# Altium project RWE_Sterownik.PrjPcb
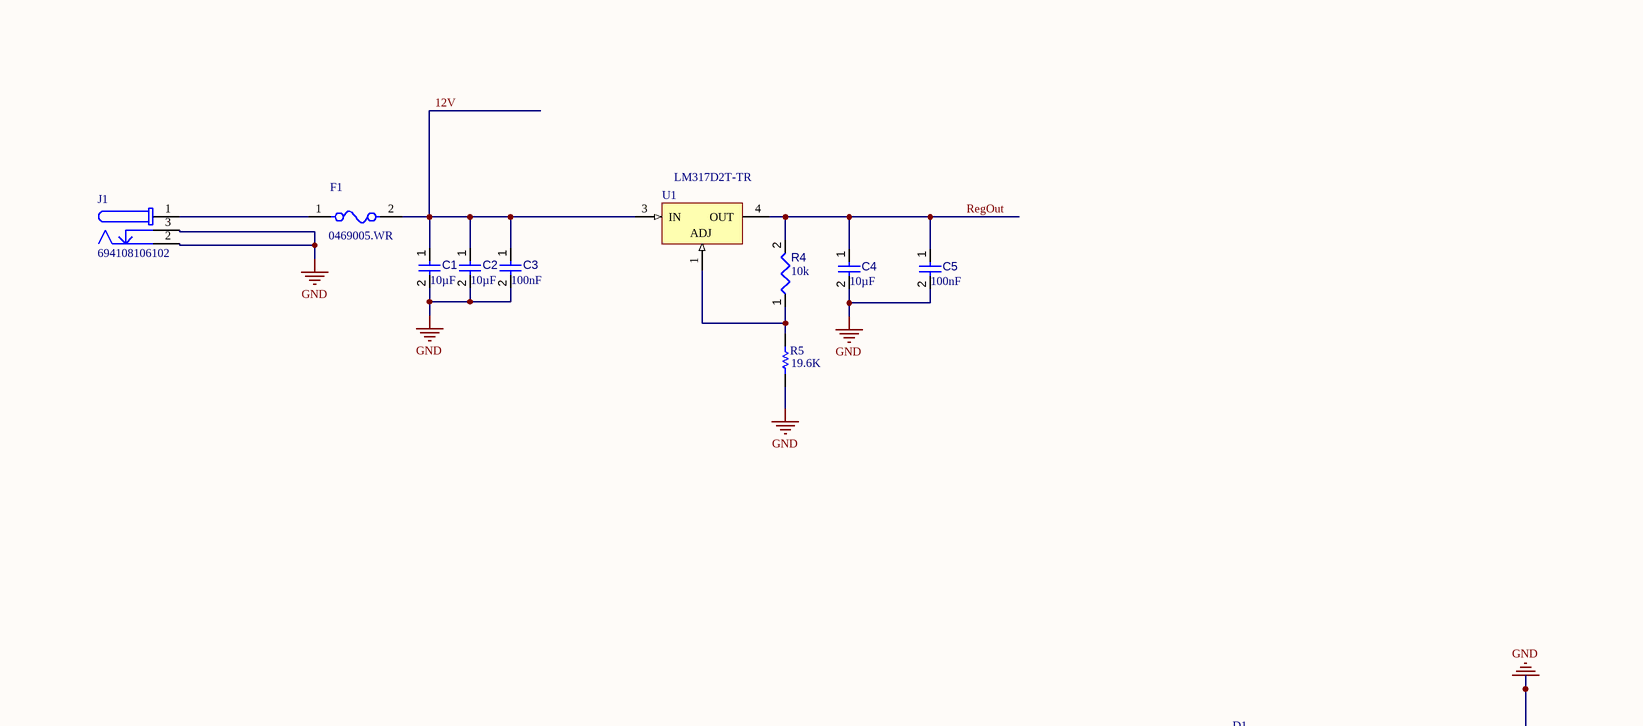
[diagram p0: Główna_Płytka.SchDoc, top left]
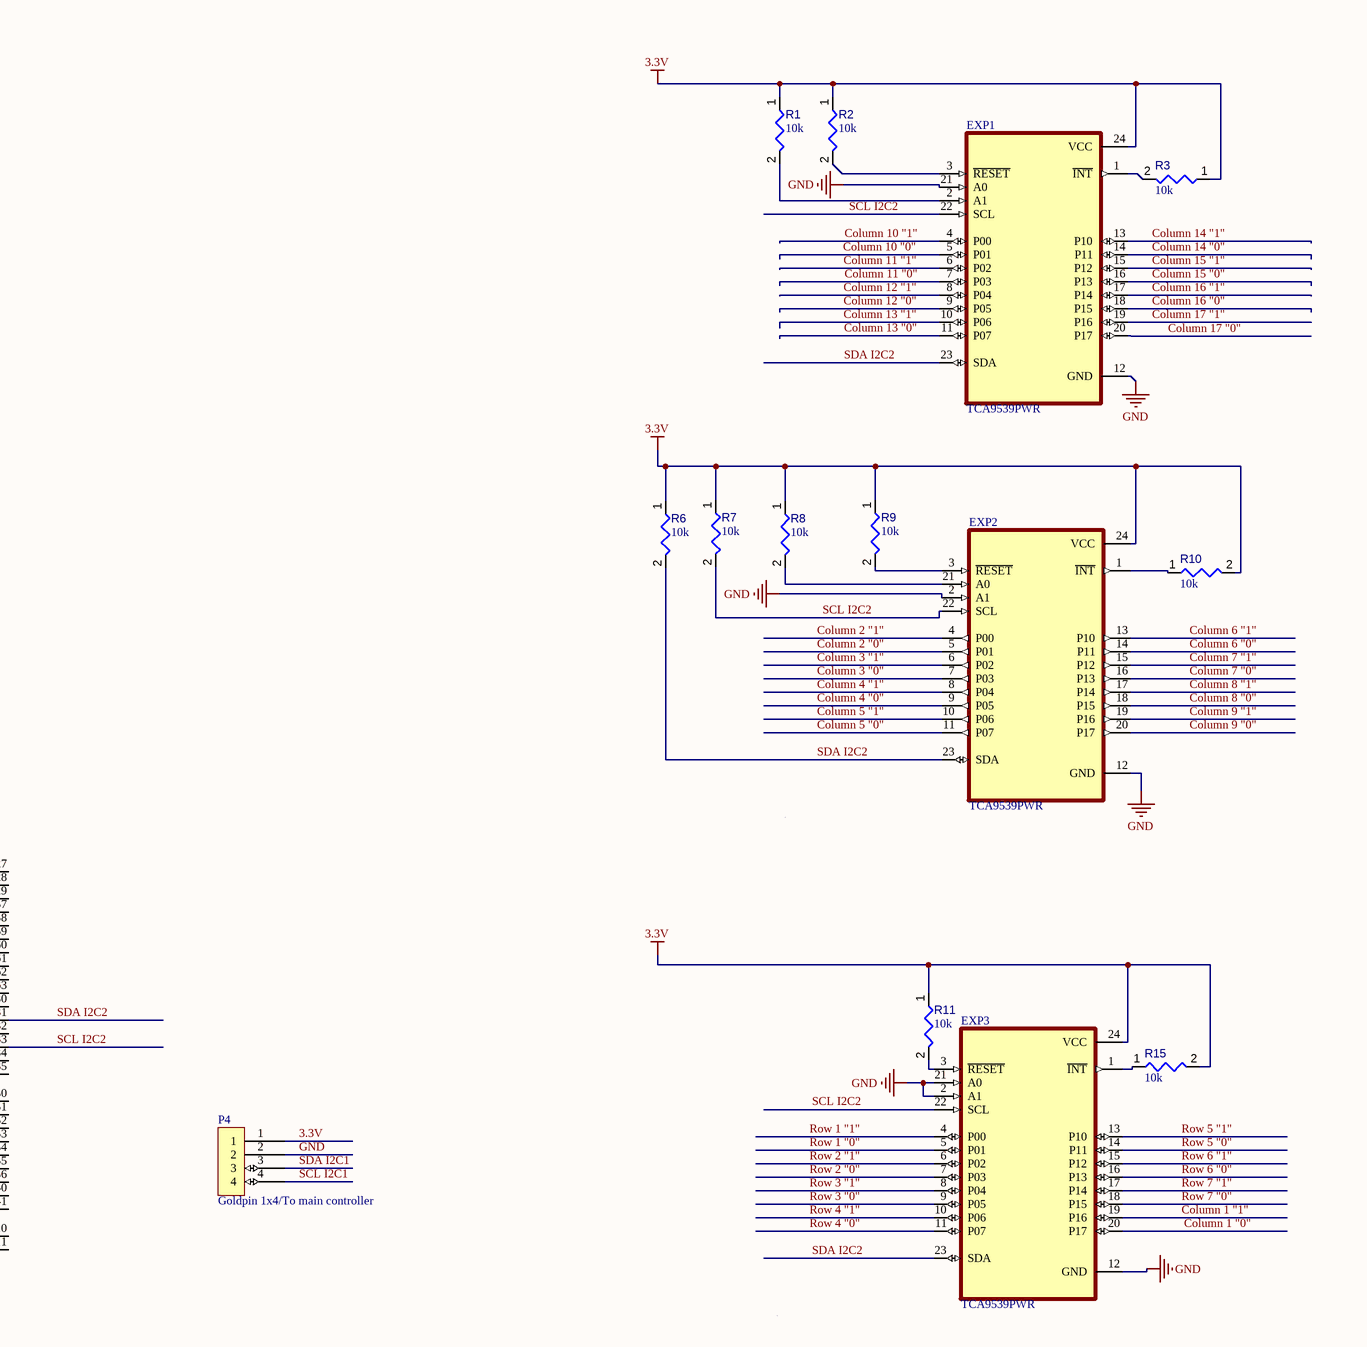
[diagram p1: Główna_Płytka.SchDoc, top middle]
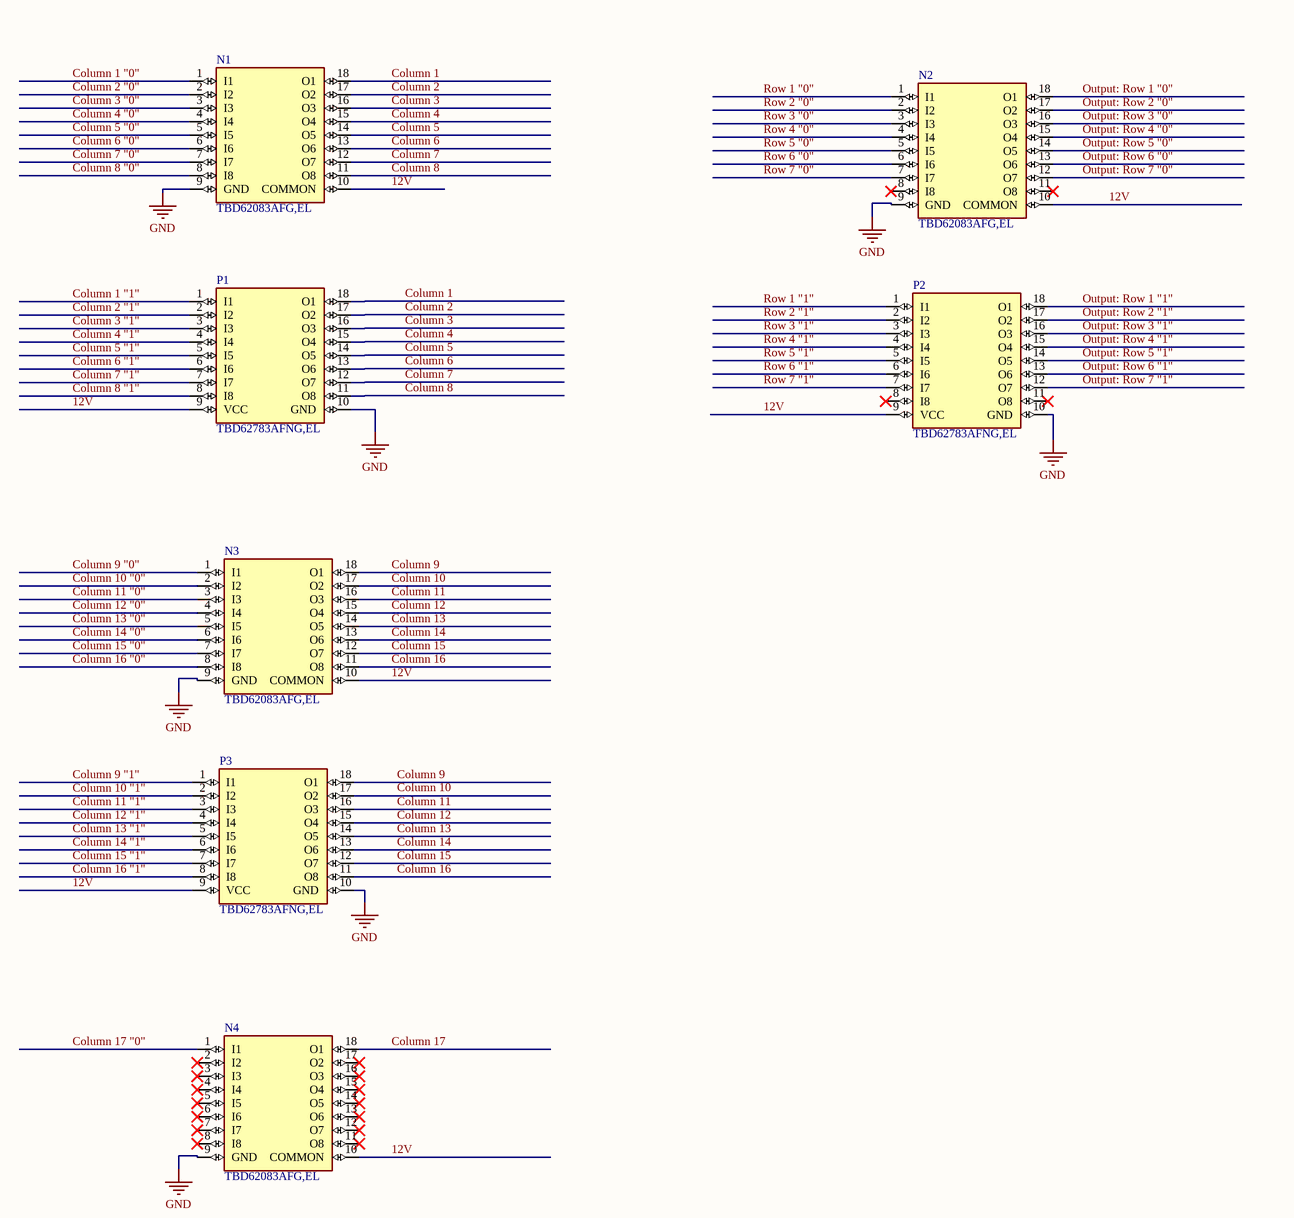
[diagram p2: Główna_Płytka.SchDoc, top right]
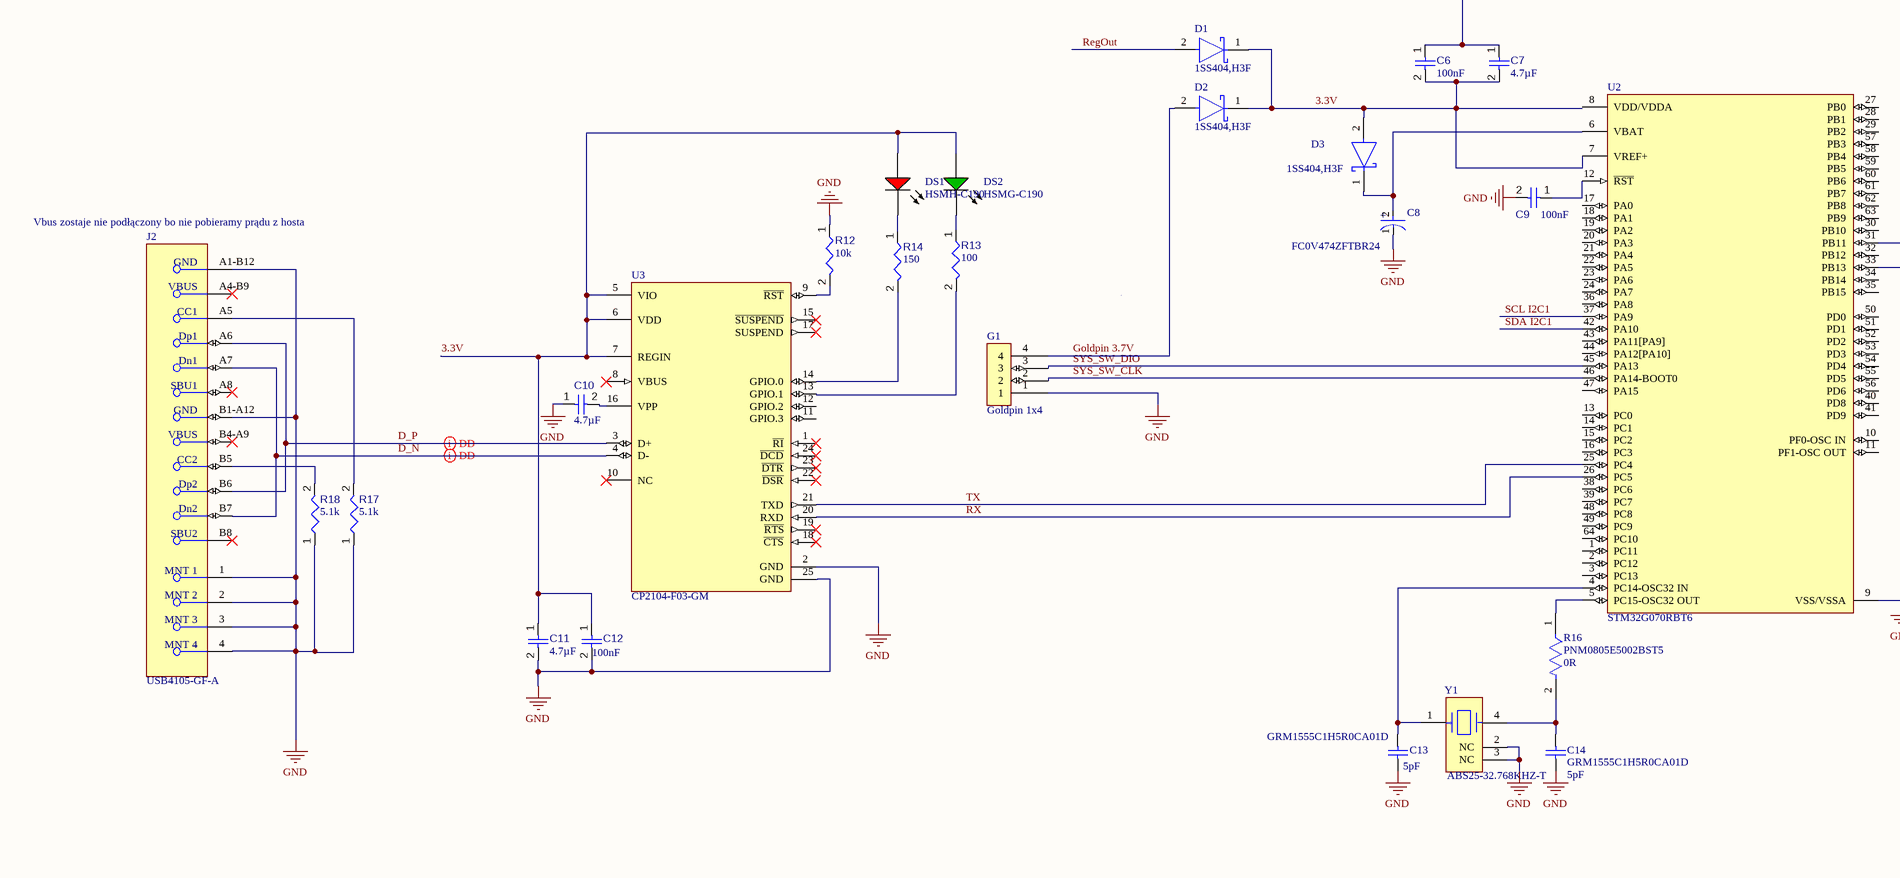
[diagram p3: Główna_Płytka.SchDoc, bottom left]
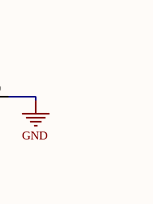
[diagram p4: Główna_Płytka.SchDoc, bottom middle]
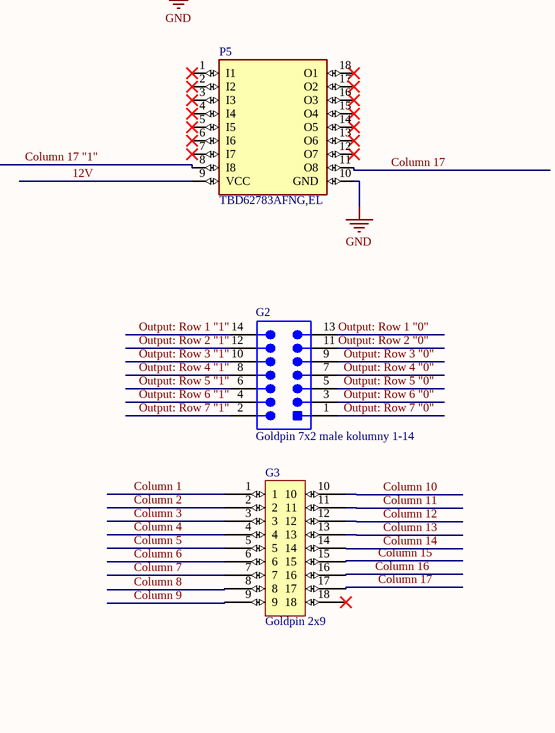
[diagram p5: Główna_Płytka.SchDoc, bottom right]
1 sheet, 59 parts. Net scope: global (net labels, ports and power ports of the same name join across sheets).
Board file: PCB1.PcbDoc

## Sheet Główna_Płytka.SchDoc
size A0; SheetNumber: 1; SheetTotal: 1

### Parts
C1  value 10µF  [CAPC0603(1608)100_L]  (hidden comment: Capacitor 10µF +/-20% 10V 0603)
C2  value 10µF  [CAPC0603(1608)100_L]  (hidden comment: Capacitor 10µF +/-20% 10V 0603)
C3  value 100nF  [CAPC0402(1005)60_L]  (hidden comment: Capacitor 100nF +/-20% 50V 0402)
C4  value 10µF  [CAPC0603(1608)100_L]  (hidden comment: Capacitor 10µF +/-20% 10V 0603)
C5  value 100nF  [CAPC0402(1005)60_L]  (hidden comment: Capacitor 100nF +/-20% 50V 0402)
C6  value 100nF  [CAPC0402(1005)60_L]  (hidden comment: Capacitor 100nF +/-20% 10V 0402)
C7  value 4.7µF  [CAPC0603(1608)100_L]  (hidden comment: Capacitor 4.7µF +/-20% 10V 0603)
C8  FC0V474ZFTBR24  [FP-FC0V474ZFTBR24-MFG]
C9  value 100nF  [CAPC0402(1005)60_L]  (hidden comment: Capacitor 100nF +/-20% 50V 0402)
C10  value 4.7µF  [CAPC0603(1608)100_L]  (hidden comment: Capacitor 4.7µF +/-20% 10V 0603)
C11  value 4.7µF  [CAPC0603(1608)100_L]  (hidden comment: Capacitor 4.7µF +/-20% 10V 0603)
C12  value 100nF  [CAPC0402(1005)60_L]  (hidden comment: Capacitor 100nF +/-20% 50V 0402)
C13  GRM1555C1H5R0CA01D  value 5pF  [CAPC1005X55X25LL05T10]
C14  GRM1555C1H5R0CA01D  value 5pF  [CAPC1005X55X25LL05T10]
D1  1SS404,H3F  [FP-SOD-323-MFG]
D2  1SS404,H3F  [FP-SOD-323-MFG]
D3  1SS404,H3F  [FP-SOD-323-MFG]
DS1  HSMH-C190  [AVAG-HSMX-C190_V]
DS2  HSMG-C190  [AVAG-HSMX-C190_V]
EXP1  TCA9539PWR  [SOP65P640X120-24N]
EXP2  TCA9539PWR  [SOP65P640X120-24N]
EXP3  TCA9539PWR  [SOP65P640X120-24N]
F1  0469005.WR  [FP-0469-MFG]
G1  Goldpin 1x4  [Goldpin 1x4-Footprint-1]
G2  Goldpin 7x2 male kolumny 1-14  [HRWN-M20-9980745_V]
G3  Goldpin 2x9  [Goldpin 2x9-Footprint-1]
J1  694108106102  [694108106102]
J2  USB4105-GF-A  [FP-USB4105-GF-A-MFG]
N1  TBD62083AFG,EL  [SOIC127P1030X245-18N]
N2  TBD62083AFG,EL  [SOIC127P1030X245-18N]
N3  TBD62083AFG,EL  [SOIC127P1030X245-18N]
N4  TBD62083AFG,EL  [SOIC127P1030X245-18N]
P1  TBD62783AFNG,EL  [New footprint 1]
P2  TBD62783AFNG,EL  [New footprint 1]
P3  TBD62783AFNG,EL  [New footprint 1]
P4  Goldpin 1x4/To main controller  [Goldpin 1x4-Footprint-1]
P5  TBD62783AFNG,EL  [New footprint 1]
R1  value 10k  [RESC2013X50X35ML15T15]  (hidden comment: Resistor 10k +/-1% 0805 125 mW)
R2  value 10k  [RESC2013X50X35ML15T15]  (hidden comment: Resistor 10k +/-1% 0805 125 mW)
R3  value 10k  [RESC2013X50X35ML15T15]  (hidden comment: Resistor 10k +/-1% 0805 125 mW)
R4  value 10k  [RESC2013X50X35ML15T15]  (hidden comment: Resistor 10k +/-1% 0805 125 mW)
R5  value 19.6K  [RESC1005X40X25NL05T05]  (hidden comment: ERJ-2RKF1962X)
R6  value 10k  [RESC2013X50X35ML15T15]  (hidden comment: Resistor 10k +/-1% 0805 125 mW)
R7  value 10k  [RESC2013X50X35ML15T15]  (hidden comment: Resistor 10k +/-1% 0805 125 mW)
R8  value 10k  [RESC2013X50X35ML15T15]  (hidden comment: Resistor 10k +/-1% 0805 125 mW)
R9  value 10k  [RESC2013X50X35ML15T15]  (hidden comment: Resistor 10k +/-1% 0805 125 mW)
R10  value 10k  [RESC2013X50X35ML15T15]  (hidden comment: Resistor 10k +/-1% 0805 125 mW)
R11  value 10k  [RESC2013X50X35ML15T15]  (hidden comment: Resistor 10k +/-1% 0805 125 mW)
R12  value 10k  [RESC2013X50X35ML15T15]  (hidden comment: Resistor 10k +/-1% 0805 125 mW)
R13  value 100  [RESC2013X50X35ML15T15]  (hidden comment: Resistor 10k +/-1% 0805 125 mW)
R14  value 150  [RESC2013X50X35ML15T15]  (hidden comment: Resistor 10k +/-1% 0805 125 mW)
R15  value 10k  [RESC2013X50X35ML15T15]  (hidden comment: Resistor 10k +/-1% 0805 125 mW)
R16  PNM0805E5002BST5  Resistance: 0R  [FP-PNM0805-MFG]
R17  value 5.1k  [RESC2013X50X35ML15T15]  (hidden comment: Resistor 10k +/-1% 0805 125 mW)
R18  value 5.1k  [RESC2013X50X35ML15T15]  (hidden comment: Resistor 10k +/-1% 0805 125 mW)
U1  LM317D2T-TR  [TO-263_N]
U2  STM32G070RBT6  [FP-LQFP64-5W-MFG]
U3  CP2104-F03-GM  [FP-CP2104-F03-GM-MFG]
Y1  ABS25-32.768KHZ-T  [FP-ABS25-MFG]

### Nets
3.3V: C6.2 C7.2 C11.1 C12.1 D1.1(C) D2.1(C) D3.2(A) DS1.1(A) DS2.1(A) EXP1.24(VCC) EXP2.24(VCC) EXP3.24(VCC) P4.1 R1.1 R2.1 R3.1 R6.1 R7.1 R8.1 R9.1 R10.2 R11.1 R15.2 U2.7(VREF+) U3.5(VIO) U3.6(VDD) U3.7(REGIN)
GND: C1.2 C2.2 C3.2 C4.2 C5.2 C6.1 C7.1 C8.1(C) C9.2 C10.1 C11.2 C12.2 C13.1 C14.1 EXP1.12(GND) EXP1.21(A0) EXP2.2(A1) EXP2.12(GND) EXP3.2(A1) EXP3.12(GND) EXP3.21(A0) G1.1 J1.2 J1.3 J2.1(MNT_1) J2.2(MNT_2) J2.3(MNT_3) J2.4(MNT_4) J2.A1-B12(GND) J2.B1-A12(GND) N1.9(GND) N2.9(GND) N3.9(GND) N4.9(GND) P1.10(GND) P2.10(GND) P3.10(GND) P4.2 P5.10(GND) R5.2 R12.1 R17.1 R18.1 U2.9(VSS/VSSA) U3.2(GND) U3.25(GND) Y1.2(NC) Y1.3(NC)
12V: C1.1 C2.1 C3.1 F1.2 N1.10(COMMON) N2.10(COMMON) N3.10(COMMON) N4.10(COMMON) P1.9(VCC) P2.9(VCC) P3.9(VCC) P5.9(VCC) U1.3(IN)
Column 1: G3.1 N1.18(O1) P1.18(O1)
Column 1 "0": EXP3.20(P17) N1.1(I1)
Column 1 "1": EXP3.19(P16) P1.1(I1)
Column 2: G3.2 N1.17(O2) P1.17(O2)
Column 2 "0": EXP2.5(P01) N1.2(I2)
Column 2 "1": EXP2.4(P00) P1.2(I2)
Column 3: G3.3 N1.16(O3) P1.16(O3)
Column 3 "0": EXP2.7(P03) N1.3(I3)
Column 3 "1": EXP2.6(P02) P1.3(I3)
Column 4: G3.4 N1.15(O4) P1.15(O4)
Column 4 "0": EXP2.9(P05) N1.4(I4)
Column 4 "1": EXP2.8(P04) P1.4(I4)
Column 5: G3.5 N1.14(O5) P1.14(O5)
Column 5 "0": EXP2.11(P07) N1.5(I5)
Column 5 "1": EXP2.10(P06) P1.5(I5)
Column 6: G3.6 N1.13(O6) P1.13(O6)
Column 6 "0": EXP2.14(P11) N1.6(I6)
Column 6 "1": EXP2.13(P10) P1.6(I6)
Column 7: G3.7 N1.12(O7) P1.12(O7)
Column 7 "0": EXP2.16(P13) N1.7(I7)
Column 7 "1": EXP2.15(P12) P1.7(I7)
Column 8: G3.8 N1.11(O8) P1.11(O8)
Column 8 "0": EXP2.18(P15) N1.8(I8)
Column 8 "1": EXP2.17(P14) P1.8(I8)
Column 9: G3.9 N3.18(O1) P3.18(O1)
Column 9 "0": EXP2.20(P17) N3.1(I1)
Column 9 "1": EXP2.19(P16) P3.1(I1)
Column 10: G3.10 N3.17(O2) P3.17(O2)
Column 10 "0": EXP1.5(P01) N3.2(I2)
Column 10 "1": EXP1.4(P00) P3.2(I2)
Column 11: G3.11 N3.16(O3) P3.16(O3)
Column 11 "0": EXP1.7(P03) N3.3(I3)
Column 11 "1": EXP1.6(P02) P3.3(I3)
Column 12: G3.12 N3.15(O4) P3.15(O4)
Column 12 "0": EXP1.9(P05) N3.4(I4)
Column 12 "1": EXP1.8(P04) P3.4(I4)
Column 13: G3.13 N3.14(O5) P3.14(O5)
Column 13 "0": EXP1.11(P07) N3.5(I5)
Column 13 "1": EXP1.10(P06) P3.5(I5)
Column 14: G3.14 N3.13(O6) P3.13(O6)
Column 14 "0": EXP1.14(P11) N3.6(I6)
Column 14 "1": EXP1.13(P10) P3.6(I6)
Column 15: G3.15 N3.12(O7) P3.12(O7)
Column 15 "0": EXP1.16(P13) N3.7(I7)
Column 15 "1": EXP1.15(P12) P3.7(I7)
Column 16: G3.16 N3.11(O8) P3.11(O8)
Column 16 "0": EXP1.18(P15) N3.8(I8)
Column 16 "1": EXP1.17(P14) P3.8(I8)
Column 17: G3.17 N4.18(O1) P5.11(O8)
Column 17 "0": EXP1.20(P17) N4.1(I1)
Column 17 "1": EXP1.19(P16) P5.8(I8)
D_N: J2.A7(Dn1) J2.B7(Dn2) U3.4(D-)
D_P: J2.A6(Dp1) J2.B6(Dp2) U3.3(D+)
Goldpin 3.7V: D2.2(A) G1.4
Output: Row 1 "0": G2.13 N2.18(O1)
Output: Row 1 "1": G2.14 P2.18(O1)
Output: Row 2 "0": G2.11 N2.17(O2)
Output: Row 2 "1": G2.12 P2.17(O2)
Output: Row 3 "0": G2.9 N2.16(O3)
Output: Row 3 "1": G2.10 P2.16(O3)
Output: Row 4 "0": G2.7 N2.15(O4)
Output: Row 4 "1": G2.8 P2.15(O4)
Output: Row 5 "0": G2.5 N2.14(O5)
Output: Row 5 "1": G2.6 P2.14(O5)
Output: Row 6 "0": G2.3 N2.13(O6)
Output: Row 6 "1": G2.4 P2.13(O6)
Output: Row 7 "0": G2.1 N2.12(O7)
Output: Row 7 "1": G2.2 P2.12(O7)
RegOut: C4.1 C5.1 D1.2(A) R4.2 U1.4(OUT)
Row 1 "0": EXP3.5(P01) N2.1(I1)
Row 1 "1": EXP3.4(P00) P2.1(I1)
Row 2 "0": EXP3.7(P03) N2.2(I2)
Row 2 "1": EXP3.6(P02) P2.2(I2)
Row 3 "0": EXP3.9(P05) N2.3(I3)
Row 3 "1": EXP3.8(P04) P2.3(I3)
Row 4 "0": EXP3.11(P07) N2.4(I4)
Row 4 "1": EXP3.10(P06) P2.4(I4)
Row 5 "0": EXP3.14(P11) N2.5(I5)
Row 5 "1": EXP3.13(P10) P2.5(I5)
Row 6 "0": EXP3.16(P13) N2.6(I6)
Row 6 "1": EXP3.15(P12) P2.6(I6)
Row 7 "0": EXP3.18(P15) N2.7(I7)
Row 7 "1": EXP3.17(P14) P2.7(I7)
RX: U2.26(PC5) U3.20(RXD)
SCL I2C1: P4.4 U2.37(PA9)
SCL I2C2: EXP1.22(SCL) EXP2.22(SCL) EXP3.22(SCL) R7.2 U2.33(PB13)
SDA I2C1: P4.3 U2.42(PA10)
SDA I2C2: EXP1.23(SDA) EXP2.23(SDA) EXP3.23(SDA) R6.2 U2.31(PB11)
SYS_SW_CLK: G1.2 U2.46(PA14-BOOT0)
SYS_SW_DIO: G1.3 U2.45(PA13)
TX: U2.25(PC4) U3.21(TXD)
NetC8_2: C8.2(A) D3.1(C) U2.6(VBAT)
NetC9_1: C9.1 U2.12(~{RST})
NetC10_2: C10.2 U3.16(VPP)
NetC13_2: C13.2 U2.4(PC14-OSC32_IN) Y1.1
NetC14_2: C14.2 R16.2 Y1.4
NetDS1_2: DS1.2(K) R14.1
NetDS2_2: DS2.2(K) R13.1
NetEXP1_1: EXP1.1(~{INT}) R3.2
NetEXP1_2: EXP1.2(A1) R1.2
NetEXP1_3: EXP1.3(~{RESET}) R2.2
NetEXP2_1: EXP2.1(~{INT}) R10.1
NetEXP2_3: EXP2.3(~{RESET}) R9.2
NetEXP2_21: EXP2.21(A0) R8.2
NetEXP3_1: EXP3.1(~{INT}) R15.1
NetEXP3_3: EXP3.3(~{RESET}) R11.2
NetF1_1: F1.1 J1.1
NetJ2_A5: J2.A5(CC1) R17.2
NetJ2_B5: J2.B5(CC2) R18.2
NetR4_1: R4.1 R5.1 U1.1(ADJ)
NetR12_2: R12.2 U3.9(~{RST})
NetR13_2: R13.2 U3.13(GPIO.1)
NetR14_2: R14.2 U3.14(GPIO.0)
NetR16_1: R16.1 U2.5(PC15-OSC32_OUT)

Not connected (* = marked no-connect by the designer): G3 18*; J2 A4-B9(VBUS)* A8(SBU1)* B4-A9(VBUS)* B8(SBU2)*; N2 8(I8)* 11(O8)*; N4 2(I2)* 3(I3)* 4(I4)* 5(I5)* 6(I6)* 7(I7)* 8(I8)* 11(O8)* 12(O7)* 13(O6)* 14(O5)* 15(O4)* 16(O3)* 17(O2)*; P2 8(I8)* 11(O8)*; P5 1(I1)* 2(I2)* 3(I3)* 4(I4)* 5(I5)* 6(I6)* 7(I7)* 12(O7)* 13(O6)* 14(O5)* 15(O4)* 16(O3)* 17(O2)* 18(O1)*; U2 1(PC11) 2(PC12) 3(PC13) 8(VDD/VDDA) 10(PF0-OSC_IN) 11(PF1-OSC_OUT) 13(PC0) 14(PC1) 15(PC2) 16(PC3) 17(PA0) 18(PA1) 19(PA2) 20(PA3) 21(PA4) 22(PA5) 23(PA6) 24(PA7) 27(PB0) 28(PB1) 29(PB2) 30(PB10) 32(PB12) 34(PB14) 35(PB15) 36(PA8) 38(PC6) 39(PC7) 40(PD8) 41(PD9) 43(PA11[PA9]) 44(PA12[PA10]) 47(PA15) 48(PC8) 49(PC9) 50(PD0) 51(PD1) 52(PD2) 53(PD3) 54(PD4) 55(PD5) 56(PD6) 57(PB3) 58(PB4) 59(PB5) 60(PB6) 61(PB7) 62(PB8) 63(PB9) 64(PC10); U3 1(~{RI})* 8(VBUS)* 10(NC)* 11(GPIO.3) 12(GPIO.2) 15(~{SUSPEND})* 17(SUSPEND)* 18(~{CTS})* 19(~{RTS})* 22(~{DSR})* 23(~{DTR})* 24(~{DCD})*

### Layout directives
differential pair: D_N, D_P

### Notes on the sheet
- (near J2) Vbus zostaje nie podłączony bo nie pobieramy prądu z hosta
- (in symbol CMP-03024-000007-1) +

### Library data of the parts
C1 C2 C4 = CMP-001-00075-4: Chip Capacitor, 10µF +/-20%, 10V, 0603, Thickness 1 mm; Tolerance: 10%; Voltage Rating: 10V; Max Operating Temperature: 85°C; Pins: 2; Case/Package: 0603; Mounting Technology: SMT; Min Operating Temperature: -55°C
C3 C5 C9 C12 = CMP-001-00067-3: Chip Capacitor, 100nF +/-20%, 50V, 0402, Thickness 0.6 mm; Tolerance: 10%; Min Operating Temperature: -55°C; Pins: 2; Case/Package: 0402; Max Operating Temperature: 85°C; Voltage Rating: 50V; Mounting Technology: SMT
C6 = CMP-001-00061-3: Chip Capacitor, 100nF +/-20%, 10V, 0402, Thickness 0.6 mm; Tolerance: 20%; Mounting Technology: SMT; Voltage Rating: 10V; Max Operating Temperature: 85°C; Pins: 2; Case/Package: 0402; Min Operating Temperature: -55°C
C7 C10 C11 = CMP-001-00076-4: Chip Capacitor, 4.7µF +/-20%, 10V, 0603, Thickness 1 mm; Tolerance: 10%; Mounting Technology: SMT; Case/Package: 0603; Pins: 2; Min Operating Temperature: -55°C; Max Operating Temperature: 85°C; Voltage Rating: 10V
C8 = CMP-03024-000007-1: CAP 470mF -20% +80% 3.5V SMD; ESR (Equivalent Series Resistance): 25R; Leakage Current: 420uA; Tolerance: 80%; Package Quantity: 500; Height: 8.5mm; Diameter: 10.5mm; Radiation Hardening: No; Voltage Rating (DC): 3.5V; Min Operating Temperature: -25°C; Length: 10.8mm; Depth: 8.5mm; Voltage Rating: 3.5V; REACH SVHC: No SVHC; RoHS Compliant: Yes; Capacitance: 470mF; Mount: Surface Mount; Contact Plating: Tin; Width: 10.8mm; Voltage: 3.5V; Lead Pitch: 5mm; Height - Seated (Max): 0.335inch; Termination: SMD/SMT; Case/Package: Radial; Max Operating Temperature: 70°C; Packaging: Tape and Reel
C13 C14 = CMP-2008-04391-1: Manufacturer: Murata; Part Number: GRM1555C1H5R0CA01D
D1-D3 = CMP-35905-000002-1: DIODE SCHOTTKY 20V 300MA USC; Max Repetitive Reverse Voltage (Vrrm): 25V; Element Configuration: Single; Mount: Surface Mount; Max Reverse Voltage (DC): 20V; Forward Current: 300mA; Packaging: Tape and Reel; Case/Package: SOD; Max Operating Temperature: 100°C; Min Operating Temperature: -40°C; Contact Plating: Tin; Average Rectified Current: 300mA
DS1 = CMP-007-00014-2: LED Uni-Color Red, 65 mW, 20 mA, -40 to 85 degC, 2-Pin SMD, RoHS, Tape and Reel; Manufacturer: Avago; Nominal Vf: 1.8V; Luminous Intensity: 17mcd; Power: 78mW; Forward Current: 20mA; Lens Style: Diffused; Viewing Angle: 170degrees; Package Quantity: 4000; Colour: Red; Manufacturer URL: http://www.avagotech.com/; Min Operating Temperature: -40°C; Datasheet URL: http://docs.avagotech.com/docs/AV02-0551EN; RoHS Compliant: True; Forward Voltage: 1.8V; Pins: 2; Max Operating Temperature: 85°C; Packaging: TapeandReel; Package Reference: HSMX-C190; Datasheet Version: Mar-12; Package Description: 2-Pin Surface Mount Device, Body 1.6 x 0.8 mm, Height 0.9 mm; Case/Package: 0603; Mounting Technology: SM; Illumination Colour: Red
DS2 = CMP-007-00013-2: LED Uni-Color Green, 52 mW, 20 mA, -40 to 85 degC, 2-Pin SMD, RoHS, Tape and Reel; Manufacturer: Avago; Forward Current: 20mA; Viewing Angle: 170degrees; Luminous Intensity: 15mcd; Lens Style: Diffused; Forward Voltage: 2.2V; Power: 52mW; Mounting Technology: SM; RoHS Compliant: True; Packaging: TapeandReel; Illumination Colour: Green; Datasheet URL: http://docs.avagotech.com/docs/AV02-0551EN; Min Operating Temperature: -40°C; Max Operating Temperature: 85°C; Pins: 2; Package Description: 2-Pin Surface Mount Device, Body 1.6 x 0.8 mm, Height 0.9 mm; Nominal Vf: 2.2V; Case/Package: 0603; Manufacturer URL: http://www.avagotech.com/; Datasheet Version: Mar-12; Colour: Green; Package Reference: HSMX-C190; Package Quantity: 4000
EXP1-EXP3 = CMP-012-000001-2: Remote 16-Bit I2C and SMBus Low-Power I/O Expander w/ Interrupt Output, Reset, and Config Registers 24-TSSOP -40 to 85; MF: Texas Instruments; Design Item ID: TCA9539PWR; Availability: Unavailable; Pin Count: 24; Component Type: Standard; MP: TCA9539PWR; Texas_Instruments-Purchase-URL: https://snapeda.com/shop?store=Texas+Instruments&id=557437; Value: *; Price: None; SnapEDA_Link: https://www.snapeda.com/parts/TCA9539PWR/Texas%20Instruments/view-part/557437/?ref=snap; Package: TSSOP-24 Texas Instruments; Source: TCA9539PWR.SchLib
F1 = CMP-08605-000100-1: FUSE BOARD MOUNT 5A 32VDC 1206; Approvals: UL; Voltage Rating (DC): 32V; Blow Characteristic: TIME DELAY; DC Cold Resistance: 35mR; Power Dissipation: 1.08W; Fuse Type: Board Mount (Cartridge Style Excluded); Body Material: Ceramic; Max Operating Temperature: 150°C; Depth: 1.63mm; Radiation Hardening: No; Height: 0.9mm; Number of Pins: 2; Resistor Type: Ceramic; Terminal Material: Nickel; Case/Package: 1206; Resistance: 35mR; RoHS Compliant: Yes; Lead Free: Lead Free; Housing Material: Ceramic; Packaging: Tape and Reel; Width: 1.63mm; Mount: Surface Mount; Min Operating Temperature: -55°C; Working Voltage: 32V; Series: 469; Package Quantity: 3000; Termination: SMD/SMT; Size: 0.9mm; Case Code (Imperial): 1206; Current Rating: 5A; Case Code (Metric): 3216; Voltage Rating: 32V; Length: 3.27mm; Fuse Current: 5A
G1 = CMP-002-00078-3: Goldpin, connector, 1 row 4 pin
G2 = CMP-002-00076-1: 2 - kolumna 1 EXP1 / 4 - kolumna 2 / 6 - kolumna 3 / 8 - kolumna 4 / ... etc / 1 - kolumna 8 / 3 - kolumna 9; Connector Type: BOARD CONNECTOR; RoHS Compliant: Yes; Mounting Technology: Board
G3 = CMP-002-00079-1: Goldpin, connector, 2 row 9 pin
J1 = CMP-1502-00180-2: NexarPartId: 52645186; Shielding: Unshielded; Voltage Rating: 24V; Connector Type: Power; Insulation Resistance: 100MΩ; Current Rating: 5A; Gender: Male; RoHS: Compliant; Housing Material: Polyamide; Flammability Rating: UL94 V-0; Contact Gender: Female; Mount: Surface Mount; Termination: SMD/SMT; Contact Plating: Tin; Max Operating Temperature: 85°C; Operating Supply Voltage: 24V; Voltage Rating (DC): 24V; REACH SVHC: Unknown; Packaging: Tape and Reel; Min Operating Temperature: -40°C; Color: Black
J2 = CMP-245163-000001-1: CONN RCPT USB2.0 TYPEC 5A; Manufacturer: GCT; Voltage Rating: 20V; Is Female: yes; Current Rating: 5/6.25/1.25/0.25A; Number Of Contacts: 16; Conn Orientation: Right Angle; Device Class L1: Connectors; Category: Conn; Lead Free: Yes; RoHS: TRUE; Temperature Range High: +85°C; Digikey Description: CONN RCPT USB2.0 TYPEC 5A; Device Class L3: unset; ComponentLink2Description: Datasheet; Manufacturer Part Number: USB4105-GF-A; Package: 0; Usb Standard: USB 2.0; Device Class L2: USB Connectors; Automotive: No; Temperature Range Low: -40°C; Height: 3.46mm; Temperature: -40°C to +85°C; Contact Material: Gold,Nickel; ComponentLink2URL: https://gct.co/files/drawings/usb4105.pdf; Octopart: https://octopart.com/usb4105-gf-a-gct-106627878
N1 = CMP-011-00013-3: Power Switch/Driver 1:1 N-Channel 500mA 18-SOP / Buffer/Inverter Based Peripheral Driver, 8 Driver, 0.4A, BCD, PDSO18 / ****************************************TUTAJ*************************************** / 1 - / 2 - PA1 - kolumna 10 "0" / 3 - / 4 - PA3 kolumna 11 "0" / 5 - / 6 - PA5 kolumna 12 "0 / 7 - / 8 - PA7 kolumna 13 "0"; MF: Toshiba Semiconductor; Source: TBD62083AFG,EL.SchLib; Check_prices: https://www.snapeda.com/parts/TBD62083AFG,EL/Toshiba+Semiconductor+and+Storage/view-part/?ref=eda; Component Type: Standard; SnapEDA_Link: https://www.snapeda.com/parts/TBD62083AFG,EL/Toshiba+Semiconductor+and+Storage/view-part/?ref=snap; Case/Package: SOIC-18 Toshiba Semiconductor and Storage; Value: *; Pins: 18; Design Item ID: TBD62083AFG,EL; MP: TBD62083AFG,EL
N2-N4 = CMP-011-00013-3: Power Switch/Driver 1:1 N-Channel 500mA 18-SOP; MF: Toshiba Semiconductor; Source: TBD62083AFG,EL.SchLib; Check_prices: https://www.snapeda.com/parts/TBD62083AFG,EL/Toshiba+Semiconductor+and+Storage/view-part/?ref=eda; Component Type: Standard; SnapEDA_Link: https://www.snapeda.com/parts/TBD62083AFG,EL/Toshiba+Semiconductor+and+Storage/view-part/?ref=snap; Case/Package: SOIC-18 Toshiba Semiconductor and Storage; Value: *; Pins: 18; Design Item ID: TBD62083AFG,EL; MP: TBD62083AFG,EL
P1 = CMP-006-00021-2: Buffer/Inverter Based Peripheral Driver, 8 Driver, 0.4A, BCD, PDSO18 / ****************************************TUTAJ*************************************** / 1 - / 2 - / 3 - / 4 - / 5 - / 6 - / 7 - / 8 -
P2 P3 P5 = CMP-006-00021-2: Buffer/Inverter Based Peripheral Driver, 8 Driver, 0.4A, BCD, PDSO18
P4 = CMP-002-00078-2: Goldpin, connector, 1 row 4 pin
R1-R4 R6-R15 R17 R18 = CMP-009-00018-5: Chip Resistor, 10 KOhm, +/- 1%, 125 mW, -55 to 155 degC, 0805 (2012 Metric); Power: 125mW; Voltage Rating: 150V; Min Operating Temperature: -55°C; Mounting Technology: SM; Pins: 2; Case/Package: 0805; Tolerance: 1%; RoHS Compliant: True; Max Operating Temperature: 155°C
R5 = CMP-1011-00654-2: Manufacturer: Panasonic; Part Number: ERJ-2RKF1962X
R16 = CMP-02407-012955-1: RES SMD 50K OHM 0.1% 1/5W 0805 / //0 R aby był footprint i wytłumić raczej nieprawdopodobne wyższe harmoniczne; Power Rating: 200mW; Temperature Coefficient: 25ppm/°C; Voltage Rating (DC): 100V; Features: Moisture Resistant; Case/Package: 0805; Resistance Tolerance: 0.1%; Max Power Dissipation: 200mW; Length: 0.08inch; Case Code (Imperial): 0805; Tolerance: 0.1%; Height: 0.015inch; Termination: SMD/SMT; Packaging: Tape and Reel; Max Operating Temperature: 155°C; Case Code (Metric): 2012; Min Operating Temperature: -55°C; Number of Terminations: 2; Width: 0.05inch; Resistor Type: Thin Film; Series: PNM; RoHS Compliant: Yes; Voltage Rating: 100V
U1 = CMP-0244-00094-1: 1.5A, 1.2V to 37V Adjustable Voltage Regulator, 3-Pin D2PAK, Tape and Reel; DatasheetVersion: 1/11/2011; PackageVersion: 2011; PackageDescription: 3-Pin Transistor Outline Package 2.54 mm Pitch, 15.4 mm Lead Span (D2PAK); ComponentLink2URL: http://www.st.com/internet/com/TECHNICAL_RESOURCES/TECHNICAL_LITERATURE/DATASHEET/CD00000455.pdf; PackageReference: TO-263; ComponentLink1Description: Manufacturer URL; ComponentLink2Description: Datasheet; ComponentLink1URL: http://www.st.com
U2 = CMP-12105-000143-1: IC MCU 32BIT 128KB FLASH 64LQFP; RoHS Compliant: Yes
U3 = CMP-0511-00004-2: IC SGL USB-TO-UART BRIDGE 24QFN; Number of Transceivers: 1; Max Supply Voltage: 3.6V; Operating Supply Current: 17mA; Operating Supply Voltage: 3.3V; Data Rate: 2Mbps; Min Supply Voltage: 3V; Number of Channels: 1; Max Operating Temperature: 85°C; Contact Plating: Tin; Min Operating Temperature: -40°C; Number of Pins: 24; Case/Package: QFN; Packaging: Rail/Tube; Radiation Hardening: No; Weight: 0.001764oz
Y1 = CMP-2000-05037-2: CRYSTAL 32.7680KHZ 12.5PF SMD; ESR (Equivalent Series Resistance): 50kR; Tolerance: 20ppm; Width: 3.8mm; REACH SVHC: No SVHC; Load Capacitance: 12.5pF; Case/Package: SMD/SMT; Radiation Hardening: No; Series: ABS25; Number of Pins: 4; Mount: Surface Mount; RoHS Compliant: Yes; Packaging: Tape and Reel; Termination: SMD/SMT; Frequency Tolerance: 20ppm; Lead Free: Lead Free; Package Quantity: 1000; Min Operating Temperature: -40°C; Height: 0.098inch; Length: 8mm; Frequency: 32.768kHz; Max Operating Temperature: 85°C; Series Resistance: 50kR; Operating Frequency: 32.768 kHz; Depth: 3.8mm